# Altium project 003-00004.PrjPcb (part 2 of 2)

## Sheet Micron_DDR3_64Mx16.SchDoc: <title>
size C; CopyrightDate: 2014; Organization: Custom Embedded Solutions, LLC.; Address1: 130 Oakland Trace; Address2: Madison, AL 35758; DocumentNumber: <doc_num>; Revision: <Rev>; SheetNumber: 5; SheetTotal: 8; PageTitle: DDR3
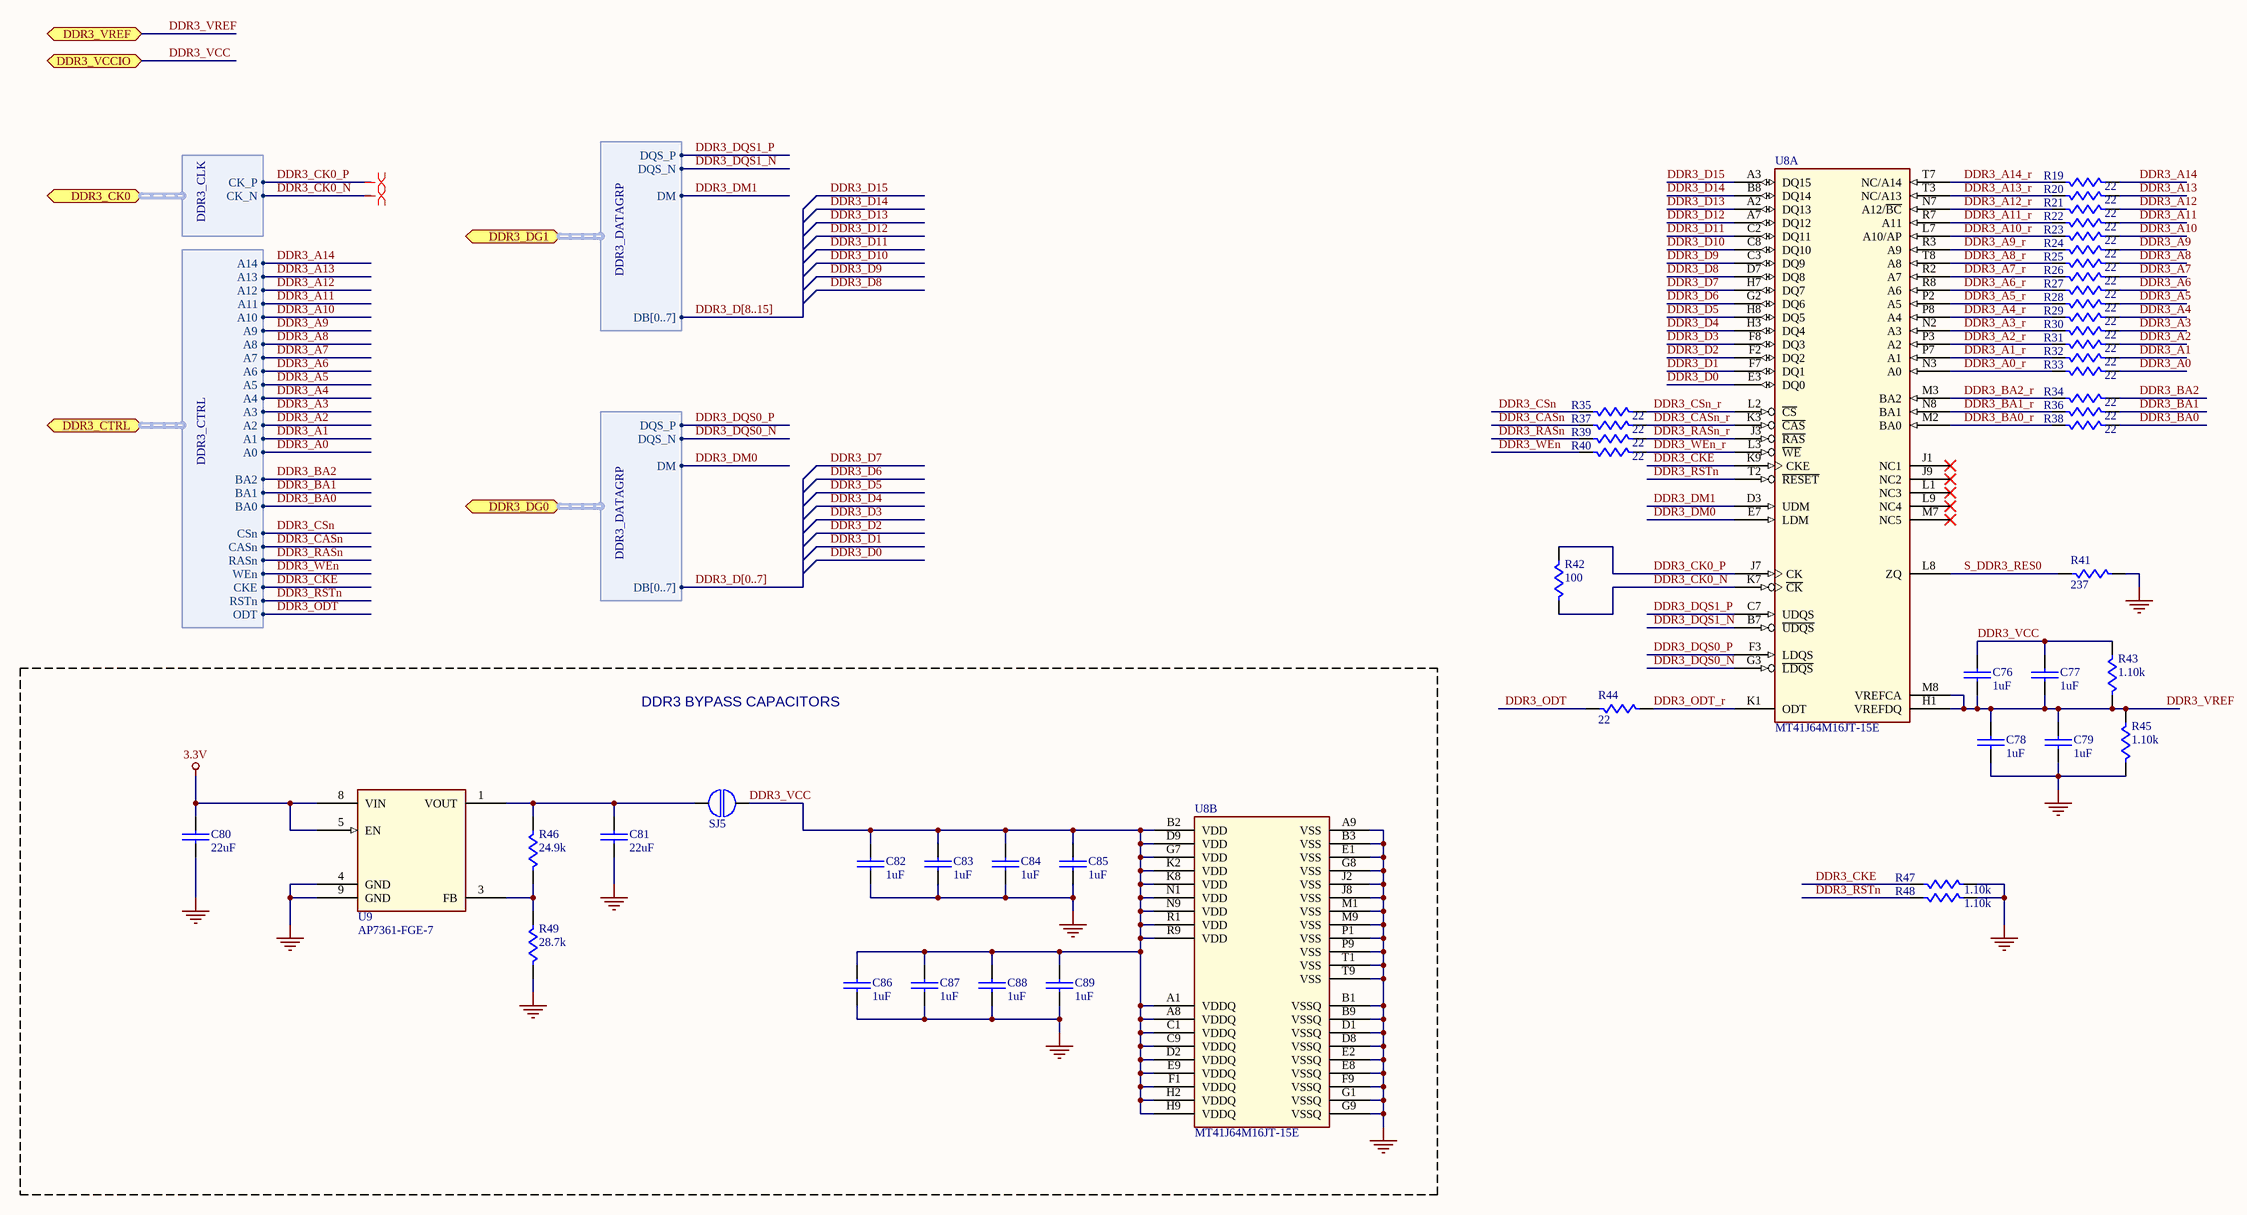
[diagram p7: Micron_DDR3_64Mx16.SchDoc]

### Parts
C76  1uF  [005-00008]
C77  1uF  [005-00008]
C78  1uF  [005-00008]
C79  1uF  [005-00008]
C80  22uF  [005-00003]
C81  22uF  [005-00003]
C82  1uF  [005-00008]
C83  1uF  [005-00008]
C84  1uF  [005-00008]
C85  1uF  [005-00008]
C86  1uF  [005-00008]
C87  1uF  [005-00008]
C88  1uF  [005-00008]
C89  1uF  [005-00008]
R19  22  [005-00009]
R20  22  [005-00009]
R21  22  [005-00009]
R22  22  [005-00009]
R23  22  [005-00009]
R24  22  [005-00009]
R25  22  [005-00009]
R26  22  [005-00009]
R27  22  [005-00009]
R28  22  [005-00009]
R29  22  [005-00009]
R30  22  [005-00009]
R31  22  [005-00009]
R32  22  [005-00009]
R33  22  [005-00009]
R34  22  [005-00009]
R35  22  [005-00009]
R36  22  [005-00009]
R37  22  [005-00009]
R38  22  [005-00009]
R39  22  [005-00009]
R40  22  [005-00009]
R41  237  [005-00009]
R42  100  [005-00009]
R43  1.10k  [005-00009]
R44  22  [005-00009]
R45  1.10k  [005-00009]
R46  24.9k  [005-00009]
R47  1.10k  [005-00009]
R48  1.10k  [005-00009]
R49  28.7k  [005-00009]
SJ5  004-00013  [005-00015]  (value not drawn)
U8  MT41J64M16JT-15E  [005-00013]  (parts A,B of 2)
U9  AP7361-FGE-7  [005-00011]

### Blocks framed on the sheet
DDR3 BYPASS CAPACITORS: C80-C89 R46 R49 SJ5 U8 U9

### Ports
DDR3_CK0 (harness DDR3_CLK), DDR3_CTRL (harness DDR3_CTRL), DDR3_DG0 (harness DDR3_DATAGRP), DDR3_DG1 (harness DDR3_DATAGRP), DDR3_VCCIO, DDR3_VREF

### Harnesses
DDR3_CLK: CK_P, CK_N
DDR3_CTRL: A14, A13, A12, A11, A10, A9, A8, A7, A6, A5, A4, A3, A2, A1, A0, BA2, BA1, BA0, CSn, RASn, CASn, WEn, CKE, RSTn, ODT
DDR3_DATAGRP: DQS_P, DQS_N, DM, DB[0..7]

### Nets
3.3V: C80.1 U9.5(EN) U9.8(VIN)
GND: C78.2 C79.2 C80.2 C81.2 C82.2 C83.2 C84.2 C85.2 C86.2 C87.2 C88.2 C89.2 R41.2 R45.1 R47.2 R48.2 R49.2 U8.A9(VSS) U8.B1(VSSQ) U8.B3(VSS) U8.B9(VSSQ) U8.D1(VSSQ) U8.D8(VSSQ) U8.E1(VSS) U8.E2(VSSQ) U8.E8(VSSQ) U8.F9(VSSQ) U8.G1(VSSQ) U8.G8(VSS) U8.G9(VSSQ) U8.J2(VSS) U8.J8(VSS) U8.M1(VSS) U8.M9(VSS) U8.P1(VSS) U8.P9(VSS) U8.T1(VSS) U8.T9(VSS) U9.4(GND) U9.9(GND)
DDR3_A0: R33.2 ; port DDR3_CTRL.A0
DDR3_A0_r: R33.1 U8.N3(A0)
DDR3_A1: R32.2 ; port DDR3_CTRL.A1
DDR3_A1_r: R32.1 U8.P7(A1)
DDR3_A2: R31.2 ; port DDR3_CTRL.A2
DDR3_A2_r: R31.1 U8.P3(A2)
DDR3_A3: R30.2 ; port DDR3_CTRL.A3
DDR3_A3_r: R30.1 U8.N2(A3)
DDR3_A4: R29.2 ; port DDR3_CTRL.A4
DDR3_A4_r: R29.1 U8.P8(A4)
DDR3_A5: R28.2 ; port DDR3_CTRL.A5
DDR3_A5_r: R28.1 U8.P2(A5)
DDR3_A6: R27.2 ; port DDR3_CTRL.A6
DDR3_A6_r: R27.1 U8.R8(A6)
DDR3_A7: R26.2 ; port DDR3_CTRL.A7
DDR3_A7_r: R26.1 U8.R2(A7)
DDR3_A8: R25.2 ; port DDR3_CTRL.A8
DDR3_A8_r: R25.1 U8.T8(A8)
DDR3_A9: R24.2 ; port DDR3_CTRL.A9
DDR3_A9_r: R24.1 U8.R3(A9)
DDR3_A10: R23.2 ; port DDR3_CTRL.A10
DDR3_A10_r: R23.1 U8.L7(A10/AP)
DDR3_A11: R22.2 ; port DDR3_CTRL.A11
DDR3_A11_r: R22.1 U8.R7(A11)
DDR3_A12: R21.2 ; port DDR3_CTRL.A12
DDR3_A12_r: R21.1 U8.N7(A12/~{BC})
DDR3_A13: R20.2 ; port DDR3_CTRL.A13
DDR3_A13_r: R20.1 U8.T3(NC/A13)
DDR3_A14: R19.2 ; port DDR3_CTRL.A14
DDR3_A14_r: R19.1 U8.T7(NC/A14)
DDR3_BA0: R38.2 ; port DDR3_CTRL.BA0
DDR3_BA0_r: R38.1 U8.M2(BA0)
DDR3_BA1: R36.2 ; port DDR3_CTRL.BA1
DDR3_BA1_r: R36.1 U8.N8(BA1)
DDR3_BA2: R34.2 ; port DDR3_CTRL.BA2
DDR3_BA2_r: R34.1 U8.M3(BA2)
DDR3_CASn: R37.1 ; port DDR3_CTRL.CASn
DDR3_CASn_r: R37.2 U8.K3(~{CAS})
DDR3_CK0_N: R42.2 U8.K7(~{CK}) ; port DDR3_CK0.CK_N
DDR3_CK0_P: R42.1 U8.J7(CK) ; port DDR3_CK0.CK_P
DDR3_CKE: R47.1 U8.K9(CKE) ; port DDR3_CTRL.CKE
DDR3_CSn: R35.1 ; port DDR3_CTRL.CSn
DDR3_CSn_r: R35.2 U8.L2(~{CS})
DDR3_D0: U8.E3(DQ0)
DDR3_D1: U8.F7(DQ1)
DDR3_D2: U8.F2(DQ2)
DDR3_D3: U8.F8(DQ3)
DDR3_D4: U8.H3(DQ4)
DDR3_D5: U8.H8(DQ5)
DDR3_D6: U8.G2(DQ6)
DDR3_D7: U8.H7(DQ7)
DDR3_D8: U8.D7(DQ8)
DDR3_D9: U8.C3(DQ9)
DDR3_D10: U8.C8(DQ10)
DDR3_D11: U8.C2(DQ11)
DDR3_D12: U8.A7(DQ12)
DDR3_D13: U8.A2(DQ13)
DDR3_D14: U8.B8(DQ14)
DDR3_D15: U8.A3(DQ15)
DDR3_DM0: U8.E7(LDM) ; port DDR3_DG0.DM
DDR3_DM1: U8.D3(UDM) ; port DDR3_DG1.DM
DDR3_DQS0_N: U8.G3(~{LDQS}) ; port DDR3_DG0.DQS_N
DDR3_DQS0_P: U8.F3(LDQS) ; port DDR3_DG0.DQS_P
DDR3_DQS1_N: U8.B7(~{UDQS}) ; port DDR3_DG1.DQS_N
DDR3_DQS1_P: U8.C7(UDQS) ; port DDR3_DG1.DQS_P
DDR3_ODT: R44.1 ; port DDR3_CTRL.ODT
DDR3_ODT_r: R44.2 U8.K1(ODT)
DDR3_RASn: R39.1 ; port DDR3_CTRL.RASn
DDR3_RASn_r: R39.2 U8.J3(~{RAS})
DDR3_RSTn: R48.1 U8.T2(~{RESET}) ; port DDR3_CTRL.RSTn
DDR3_VCC: C76.1 C77.1 C82.1 C83.1 C84.1 C85.1 C86.1 C87.1 C88.1 C89.1 R43.2 SJ5.2 U8.A1(VDDQ) U8.A8(VDDQ) U8.B2(VDD) U8.C1(VDDQ) U8.C9(VDDQ) U8.D2(VDDQ) U8.D9(VDD) U8.E9(VDDQ) U8.F1(VDDQ) U8.G7(VDD) U8.H2(VDDQ) U8.H9(VDDQ) U8.K2(VDD) U8.K8(VDD) U8.N1(VDD) U8.N9(VDD) U8.R1(VDD) U8.R9(VDD) ; port DDR3_VCCIO
DDR3_VREF: C76.2 C77.2 C78.1 C79.1 R43.1 R45.2 U8.H1(VREFDQ) U8.M8(VREFCA) ; port DDR3_VREF
DDR3_WEn: R40.1 ; port DDR3_CTRL.WEn
DDR3_WEn_r: R40.2 U8.L3(~{WE})
S_DDR3_RES0: R41.1 U8.L8(ZQ)
NetC81_1: C81.1 R46.1 SJ5.1 U9.1(VOUT)
NetR46_2: R46.2 R49.1 U9.3(FB)

Not connected (* = marked no-connect by the designer): U8 J1(NC1)* J9(NC2)* L1(NC3)* L9(NC4)* M7(NC5)*; U9 2(NC) 6(NC) 7(NC)

### Buses and harness runs
bus DDR3_D[0..7]
bus DDR3_D[8..15]

### Layout directives
differential pair: DDR3_CK0_N, DDR3_CK0_P

### Notes on the sheet
- Copyright (c)
- Page Title
- Design Title
- Creative Commons License, http://creativecommons.org/licenses/by/4.0/legalcode
  This PCB design by Custom Embedded Solutions, LLC. is licensed under a Creative Commons Attribution 4.0 International License.
- Size:
- Date:
- File:
- C
- Document Number:
- Time:
- Sheet
- Rev:
- of

### Library data of the parts
C76-C79 C82-C89 = 011-00017: CAP CER 1UF 6.3V 10% X5R 0402; Manufacturer1 Part Number: CL05A105KQ5NNNC; Manufacturer1: Samsung; Types: Y1; Type: Ceramic; Part Number: 011-00017; Substrate: X5R; Voltage: 6.3V; Value: 1uF; Package: 1005, EIA 0402, Chip Capacitor, 2-Leads, Body 1.00x0.50mm, IPC High Density
C80 C81 = 011-00004: CAP CER 22UF 6.3V X5R 20% 0805; Manufacturer1 Part Number: C2012X5R0J226M/1.25; Manufacturer1: TDK; Manufacturer2 Part Number: CL21A226KQQNNNF; Manufacturer3 Part Number: 08056D226MAT2A; 3rd Party: {Reference Design}; Type: Ceramic; Part Number: 011-00004; Voltage: 6.3V; Substrate: X5R; Manufacturer2: Samsung; Manufacturer3: AVX; Value: 22uF; Package: 2012, EIA 0805, Chip Capacitor, 2-Leads, Body 2.00x1.25mm, IPC High Density
R19-R40 R44 = 009-00020: RES 22 OHM 1/16W 5% 0402; Manufacturer1: Stackpole Electronics; Manufacturer1 Part Number: RMCF0402JT22R0; Tolerance: 0.05; Part Number: 009-00020; Power: 1/16W; Value: 22; Package: 1005, EIA 0402, Chip Resistor, 2-Leads, Body 1.00x0.50mm, IPC High Density
R41 = 009-00029: RES 237 OHM 1/10W 1% 0402 SMD; Manufacturer1 Part Number: ERJ-2RKF2370X; Manufacturer1: Panasonic; Tolerance: 0.01; Power: 1/16W; Part Number: 009-00029; Value: 237; Package: 1005, EIA 0402, Chip Resistor, 2-Leads, Body 1.00x0.50mm, IPC High Density
R42 = 009-00015: RES 100 OHM 1/16W 1% 0402 SMD; Manufacturer1: Panasonic; Manufacturer1 Part Number: ERJ-2RKF1000X; 3rd Party: {Reference Design}; Tolerance: 0.01; Part Number: 009-00015; Power: 1/16W; Value: 100; Package: 1005, EIA 0402, Chip Resistor, 2-Leads, Body 1.00x0.50mm, IPC High Density
R43 R45 R47 R48 = 009-00008: RES 1.10K OHM 1/16W 1% 0402 SMD; Manufacturer1 Part Number: RC0402FR-071K1L; Manufacturer1: Yageo; 3rd Party: {Reference Design}; Tolerance: 0.01; Part Number: 009-00008; Value: 1.10k; Power: 1/16W; Package: 1005, EIA 0402, Chip Resistor, 2-Leads, Body 1.00x0.50mm, IPC High Density
R46 = 009-00024: RES 24.9K OHM 1/10W 1% 0402 SMD; Manufacturer1 Part Number: ERJ-2RKF2492X; Manufacturer1: Panasonic; Tolerance: 0.01; Power: 1/16W; Part Number: 009-00024; Value: 24.9k; Package: 1005, EIA 0402, Chip Resistor, 2-Leads, Body 1.00x0.50mm, IPC High Density
R49 = 009-00028: RES 28.7K OHM 1/10W 1% 0402 SMD; Manufacturer1 Part Number: ERJ-2RKF2872X; Manufacturer1: Panasonic; Tolerance: 0.01; Power: 1/16W; Part Number: 009-00028; Value: 28.7k; Package: 1005, EIA 0402, Chip Resistor, 2-Leads, Body 1.00x0.50mm, IPC High Density
SJ5 = 008-00009: Solder Jumper, 50mil; Part Number: 008-00009; Package: Solder Jumper, 25x55mil
U8 = 012-00024: IC DDR3 SDRAM 1GBIT 667MHZ 96BGA; Manufacturer1: Micron; Part Number: 012-00024; Manufacturer1 Part Number: MT41J64M16JT-15E; Value: MT41J64M16JT-15E; Type: Memory; Package: FBGA 96 8x14x1.2mm 0.8mm pitch; Life Cycle: Maturity
U9 = 012-00018: IC REG LDO ADJ 1A 8DFN; Manufacturer1: Diodes Inc; Preferred: Yes; Part Number: 012-00018; Type: PMIC; Value: AP7361-FGE-7; Package: QFN, 8-Leads, Body 3.0x3.0mm (max), Pitch 0.65mm, IPC Medium Density; Manufacturer1 Part Number: AP7361-FGE-7

## Nets that join several sheets
1.2VARX: Lattice_ECP5 (8 pins), Lattice_ECP5_power (FB3.2)
1.2VATX: Lattice_ECP5 (8 pins), Lattice_ECP5_power (FB4.2)
3.3V: Lattice_ECP5 (13 pins), Lattice_ECP5_power (26 pins), UA_Expansion (P2_UA_Expansion.2 P2_UA_Expansion.4), UB_Expansion (P2_UB_Expansion.2 P2_UB_Expansion.4), MIC24085 (5 pins), FT2232HQ_LATTICE_JTAG (15 pins), Micron_DDR3_64Mx16 (C80.1 U9.5 U9.8)
GND: Lattice_ECP5 (36 pins), Lattice_ECP5_power (156 pins), UA_Expansion (20 pins), PCIe_x1_edge (11 pins), UB_Expansion (20 pins), MIC24085 (10 pins), FT2232HQ_LATTICE_JTAG (22 pins), Micron_DDR3_64Mx16 (40 pins)
VIN: PCIe_x1_edge (5 pins), MIC24085 (5 pins)
A_D0: Lattice_ECP5 (U1#1.E19), UA_Expansion (P2_UA_Expansion.51)
A_D1: Lattice_ECP5 (U1#1.H16), UA_Expansion (P2_UA_Expansion.46)
A_D2: Lattice_ECP5 (U1#1.G16), UA_Expansion (P2_UA_Expansion.48)
A_D3: Lattice_ECP5 (U1#1.F16), UA_Expansion (P2_UA_Expansion.52)
A_D4: Lattice_ECP5 (U1#1.E16), UA_Expansion (P2_UA_Expansion.54)
A_DQ0-0_N: Lattice_ECP5 (U1#1.F19), UA_Expansion (P2_UA_Expansion.13)
A_DQ0-0_P: Lattice_ECP5 (U1#1.E20), UA_Expansion (P2_UA_Expansion.15)
A_DQ0-1_N: Lattice_ECP5 (U1#1.D19), UA_Expansion (P2_UA_Expansion.19)
A_DQ0-1_P: Lattice_ECP5 (U1#1.C20), UA_Expansion (P2_UA_Expansion.21)
A_DQ0-2_N: Lattice_ECP5 (U1#1.K19), UA_Expansion (P2_UA_Expansion.25)
A_DQ0-2_P: Lattice_ECP5 (U1#1.J19), UA_Expansion (P2_UA_Expansion.27)
A_DQ0-3_N: Lattice_ECP5 (U1#1.G20), UA_Expansion (P2_UA_Expansion.33)
A_DQ0-3_P: Lattice_ECP5 (U1#1.F20), UA_Expansion (P2_UA_Expansion.35)
A_DQ0-4_N: Lattice_ECP5 (U1#1.K18), UA_Expansion (P2_UA_Expansion.39)
A_DQ0-4_P: Lattice_ECP5 (U1#1.J18), UA_Expansion (P2_UA_Expansion.41)
A_DQ1-0_N: Lattice_ECP5 (U1#1.H17), UA_Expansion (P2_UA_Expansion.14)
A_DQ1-0_P: Lattice_ECP5 (U1#1.H18), UA_Expansion (P2_UA_Expansion.16)
A_DQ1-1_N: Lattice_ECP5 (U1#1.E17), UA_Expansion (P2_UA_Expansion.20)
A_DQ1-1_P: Lattice_ECP5 (U1#1.D18), UA_Expansion (P2_UA_Expansion.22)
A_DQ1-2_N: Lattice_ECP5 (U1#1.D17), UA_Expansion (P2_UA_Expansion.26)
A_DQ1-2_P: Lattice_ECP5 (U1#1.C18), UA_Expansion (P2_UA_Expansion.28)
A_DQ1-3_N: Lattice_ECP5 (U1#1.J16), UA_Expansion (P2_UA_Expansion.34)
A_DQ1-3_P: Lattice_ECP5 (U1#1.J17), UA_Expansion (P2_UA_Expansion.36)
A_DQ1-4_N: Lattice_ECP5 (U1#1.F18), UA_Expansion (P2_UA_Expansion.40)
A_DQ1-4_P: Lattice_ECP5 (U1#1.E18), UA_Expansion (P2_UA_Expansion.42)
A_DQS0_N: Lattice_ECP5 (U1#1.H20), UA_Expansion (P2_UA_Expansion.7)
A_DQS0_P: Lattice_ECP5 (U1#1.G19), UA_Expansion (P2_UA_Expansion.9)
A_DQS1_N: Lattice_ECP5 (U1#1.G18), UA_Expansion (P2_UA_Expansion.8)
A_DQS1_P: Lattice_ECP5 (U1#1.F17), UA_Expansion (P2_UA_Expansion.10)
A_PCLK_N: Lattice_ECP5 (U1#1.K20), UA_Expansion (P2_UA_Expansion.45)
A_PCLK_P: Lattice_ECP5 (U1#1.J20), UA_Expansion (P2_UA_Expansion.47)
A_VREF: Lattice_ECP5 (U1#1.D20), UA_Expansion (P2_UA_Expansion.53)
B_D0: Lattice_ECP5 (U1#1.N17), UB_Expansion (P2_UB_Expansion.51)
B_D1: Lattice_ECP5 (U1#1.U18), UB_Expansion (P2_UB_Expansion.46)
B_D2: Lattice_ECP5 (U1#1.U17), UB_Expansion (P2_UB_Expansion.48)
B_D3: Lattice_ECP5 (U1#1.T17), UB_Expansion (P2_UB_Expansion.52)
B_D4: Lattice_ECP5 (U1#1.U16), UB_Expansion (P2_UB_Expansion.54)
B_DQ0-0_N: Lattice_ECP5 (U1#1.M18), UB_Expansion (P2_UB_Expansion.13)
B_DQ0-0_P: Lattice_ECP5 (U1#1.L18), UB_Expansion (P2_UB_Expansion.15)
B_DQ0-1_N: Lattice_ECP5 (U1#1.L17), UB_Expansion (P2_UB_Expansion.19)
B_DQ0-1_P: Lattice_ECP5 (U1#1.L16), UB_Expansion (P2_UB_Expansion.21)
B_DQ0-2_N: Lattice_ECP5 (U1#1.M20), UB_Expansion (P2_UB_Expansion.25)
B_DQ0-2_P: Lattice_ECP5 (U1#1.L20), UB_Expansion (P2_UB_Expansion.27)
B_DQ0-3_N: Lattice_ECP5 (U1#1.P17), UB_Expansion (P2_UB_Expansion.33)
B_DQ0-3_P: Lattice_ECP5 (U1#1.N18), UB_Expansion (P2_UB_Expansion.35)
B_DQ0-4_N: Lattice_ECP5 (U1#1.R17), UB_Expansion (P2_UB_Expansion.39)
B_DQ0-4_P: Lattice_ECP5 (U1#1.R16), UB_Expansion (P2_UB_Expansion.41)
B_DQ1-0_N: Lattice_ECP5 (U1#1.R20), UB_Expansion (P2_UB_Expansion.14)
B_DQ1-0_P: Lattice_ECP5 (U1#1.P20), UB_Expansion (P2_UB_Expansion.16)
B_DQ1-1_N: Lattice_ECP5 (U1#1.N20), UB_Expansion (P2_UB_Expansion.20)
B_DQ1-1_P: Lattice_ECP5 (U1#1.N19), UB_Expansion (P2_UB_Expansion.22)
B_DQ1-2_N: Lattice_ECP5 (U1#1.P18), UB_Expansion (P2_UB_Expansion.26)
B_DQ1-2_P: Lattice_ECP5 (U1#1.P19), UB_Expansion (P2_UB_Expansion.28)
B_DQ1-3_N: Lattice_ECP5 (U1#1.T18), UB_Expansion (P2_UB_Expansion.34)
B_DQ1-3_P: Lattice_ECP5 (U1#1.U19), UB_Expansion (P2_UB_Expansion.36)
B_DQ1-4_N: Lattice_ECP5 (U1#1.U20), UB_Expansion (P2_UB_Expansion.40)
B_DQ1-4_P: Lattice_ECP5 (U1#1.T20), UB_Expansion (P2_UB_Expansion.42)
B_DQS0_N: Lattice_ECP5 (U1#1.M17), UB_Expansion (P2_UB_Expansion.7)
B_DQS0_P: Lattice_ECP5 (U1#1.N16), UB_Expansion (P2_UB_Expansion.9)
B_DQS1_N: Lattice_ECP5 (U1#1.R18), UB_Expansion (P2_UB_Expansion.8)
B_DQS1_P: Lattice_ECP5 (U1#1.T19), UB_Expansion (P2_UB_Expansion.10)
B_PCLK_N: Lattice_ECP5 (U1#1.M19), UB_Expansion (P2_UB_Expansion.45)
B_PCLK_P: Lattice_ECP5 (U1#1.L19), UB_Expansion (P2_UB_Expansion.47)
B_VREF: Lattice_ECP5 (U1#1.P16), UB_Expansion (P2_UB_Expansion.53)
DDR3_A0: Lattice_ECP5 (U1#1.D2), Micron_DDR3_64Mx16 (R33.2)
DDR3_A1: Lattice_ECP5 (U1#1.K1), Micron_DDR3_64Mx16 (R32.2)
DDR3_A2: Lattice_ECP5 (U1#1.C2), Micron_DDR3_64Mx16 (R31.2)
DDR3_A3: Lattice_ECP5 (U1#1.D1), Micron_DDR3_64Mx16 (R30.2)
DDR3_A4: Lattice_ECP5 (U1#1.L1), Micron_DDR3_64Mx16 (R29.2)
DDR3_A5: Lattice_ECP5 (U1#1.C1), Micron_DDR3_64Mx16 (R28.2)
DDR3_A6: Lattice_ECP5 (U1#1.L2), Micron_DDR3_64Mx16 (R27.2)
DDR3_A7: Lattice_ECP5 (U1#1.B1), Micron_DDR3_64Mx16 (R26.2)
DDR3_A8: Lattice_ECP5 (U1#1.N1), Micron_DDR3_64Mx16 (R25.2)
DDR3_A9: Lattice_ECP5 (U1#1.A2), Micron_DDR3_64Mx16 (R24.2)
DDR3_A10: Lattice_ECP5 (U1#1.J1), Micron_DDR3_64Mx16 (R23.2)
DDR3_A11: Lattice_ECP5 (U1#1.P1), Micron_DDR3_64Mx16 (R22.2)
DDR3_A12: Lattice_ECP5 (U1#1.K2), Micron_DDR3_64Mx16 (R21.2)
DDR3_A13: Lattice_ECP5 (U1#1.A3), Micron_DDR3_64Mx16 (R20.2)
DDR3_A14: Lattice_ECP5 (U1#1.P2), Micron_DDR3_64Mx16 (R19.2)
DDR3_BA0: Lattice_ECP5 (U1#1.E2), Micron_DDR3_64Mx16 (R38.2)
DDR3_BA1: Lattice_ECP5 (U1#1.K3), Micron_DDR3_64Mx16 (R36.2)
DDR3_BA2: Lattice_ECP5 (U1#1.E1), Micron_DDR3_64Mx16 (R34.2)
DDR3_CASn: Lattice_ECP5 (U1#1.G2), Micron_DDR3_64Mx16 (R37.1)
DDR3_CK0_N: Lattice_ECP5 (U1#1.G1), Micron_DDR3_64Mx16 (R42.2 U8.K7)
DDR3_CK0_P: Lattice_ECP5 (U1#1.H2), Micron_DDR3_64Mx16 (R42.1 U8.J7)
DDR3_CKE: Lattice_ECP5 (U1#1.J5), Micron_DDR3_64Mx16 (R47.1 U8.K9)
DDR3_CSn: Lattice_ECP5 (U1#1.F2), Micron_DDR3_64Mx16 (R35.1)
DDR3_D0: Lattice_ECP5 (U1#1.C5), Micron_DDR3_64Mx16 (U8.E3)
DDR3_D1: Lattice_ECP5 (U1#1.C3), Micron_DDR3_64Mx16 (U8.F7)
DDR3_D2: Lattice_ECP5 (U1#1.B4), Micron_DDR3_64Mx16 (U8.F2)
DDR3_D3: Lattice_ECP5 (U1#1.D3), Micron_DDR3_64Mx16 (U8.F8)
DDR3_D4: Lattice_ECP5 (U1#1.A5), Micron_DDR3_64Mx16 (U8.H3)
DDR3_D5: Lattice_ECP5 (U1#1.B3), Micron_DDR3_64Mx16 (U8.H8)
DDR3_D6: Lattice_ECP5 (U1#1.B5), Micron_DDR3_64Mx16 (U8.G2)
DDR3_D7: Lattice_ECP5 (U1#1.C4), Micron_DDR3_64Mx16 (U8.H7)
DDR3_D8: Lattice_ECP5 (U1#1.P5), Micron_DDR3_64Mx16 (U8.D7)
DDR3_D9: Lattice_ECP5 (U1#1.L3), Micron_DDR3_64Mx16 (U8.C3)
DDR3_D10: Lattice_ECP5 (U1#1.P3), Micron_DDR3_64Mx16 (U8.C8)
DDR3_D11: Lattice_ECP5 (U1#1.M4), Micron_DDR3_64Mx16 (U8.C2)
DDR3_D12: Lattice_ECP5 (U1#1.N3), Micron_DDR3_64Mx16 (U8.A7)
DDR3_D13: Lattice_ECP5 (U1#1.N5), Micron_DDR3_64Mx16 (U8.A2)
DDR3_D14: Lattice_ECP5 (U1#1.P4), Micron_DDR3_64Mx16 (U8.B8)
DDR3_D15: Lattice_ECP5 (U1#1.N4), Micron_DDR3_64Mx16 (U8.A3)
DDR3_DM0: Lattice_ECP5 (U1#1.E3), Micron_DDR3_64Mx16 (U8.E7)
DDR3_DM1: Lattice_ECP5 (U1#1.M3), Micron_DDR3_64Mx16 (U8.D3)
DDR3_DQS0_N: Lattice_ECP5 (U1#1.D5), Micron_DDR3_64Mx16 (U8.G3)
DDR3_DQS0_P: Lattice_ECP5 (U1#1.E4), Micron_DDR3_64Mx16 (U8.F3)
DDR3_DQS1_N: Lattice_ECP5 (U1#1.M1), Micron_DDR3_64Mx16 (U8.B7)
DDR3_DQS1_P: Lattice_ECP5 (U1#1.N2), Micron_DDR3_64Mx16 (U8.C7)
DDR3_ODT: Lattice_ECP5 (U1#1.A4), Micron_DDR3_64Mx16 (R44.1)
DDR3_RASn: Lattice_ECP5 (U1#1.H1), Micron_DDR3_64Mx16 (R39.1)
DDR3_RSTn: Lattice_ECP5 (U1#1.L5), Micron_DDR3_64Mx16 (R48.1 U8.T2)
DDR3_VCC: Lattice_ECP5 (14 pins), Micron_DDR3_64Mx16 (30 pins)
DDR3_VREF: Lattice_ECP5 (C19.1 C20.1 U1#1.B2 U1#1.K5), Micron_DDR3_64Mx16 (8 pins)
DDR3_WEn: Lattice_ECP5 (U1#1.F1), Micron_DDR3_64Mx16 (R40.1)
JTAG_TCK: Lattice_ECP5_power (P1.4 R9#1.1 U1#1.T5), FT2232HQ_LATTICE_JTAG (U2#2.16)
JTAG_TDI: Lattice_ECP5_power (P1.2 U1#1.R5), FT2232HQ_LATTICE_JTAG (U2#2.17)
JTAG_TDO: Lattice_ECP5_power (P1.3 U1#1.V4), FT2232HQ_LATTICE_JTAG (U2#2.18)
JTAG_TMS: Lattice_ECP5_power (P1.5 U1#1.U5), FT2232HQ_LATTICE_JTAG (U2#2.19)
PER0_N: Lattice_ECP5 (U1#1.W5), PCIe_x1_edge (C75.2)
PER0_P: Lattice_ECP5 (U1#1.W4), PCIe_x1_edge (C74.2)
PERSTn: Lattice_ECP5 (U1#1.B19), PCIe_x1_edge (P3.A11)
PET0_N: Lattice_ECP5 (U1#1.Y6), PCIe_x1_edge (P3.B15)
PET0_P: Lattice_ECP5 (U1#1.Y5), PCIe_x1_edge (P3.B14)
REFCLK_N: Lattice_ECP5 (U1#1.Y12), PCIe_x1_edge (P3.A14)
REFCLK_P: Lattice_ECP5 (U1#1.Y11), PCIe_x1_edge (P3.A13)
TOP8: Lattice_ECP5 (U1#1.A8), FT2232HQ_LATTICE_JTAG (U2#2.38)
TOP18: Lattice_ECP5 (U1#1.A9), FT2232HQ_LATTICE_JTAG (U2#2.39)
VCC_EXPA: Lattice_ECP5 (7 pins), UA_Expansion (P2_UA_Expansion.1 P2_UA_Expansion.3)
VCC_EXPB: Lattice_ECP5 (7 pins), UB_Expansion (P2_UB_Expansion.1 P2_UB_Expansion.3)

## Assembly variants
001-00004: not fitted C83 P1 R21 R22 R23 R25 U9